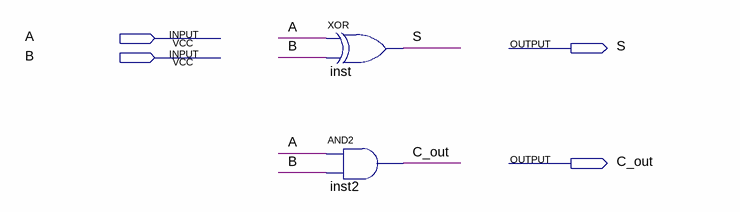
[diagram p0: schematic sheet]
// Quartus schematic HA.bdf as structural Verilog: 2 symbols, 4 pins
module HA (
  input  A,
  input  B,
  output S,
  output C_out
);

  xor inst (S, A, B);
  and inst2 (C_out, A, B);
endmodule
